# EAGLE design 40khz_ultrasonic_receiver (EAGLE 6.5.0)
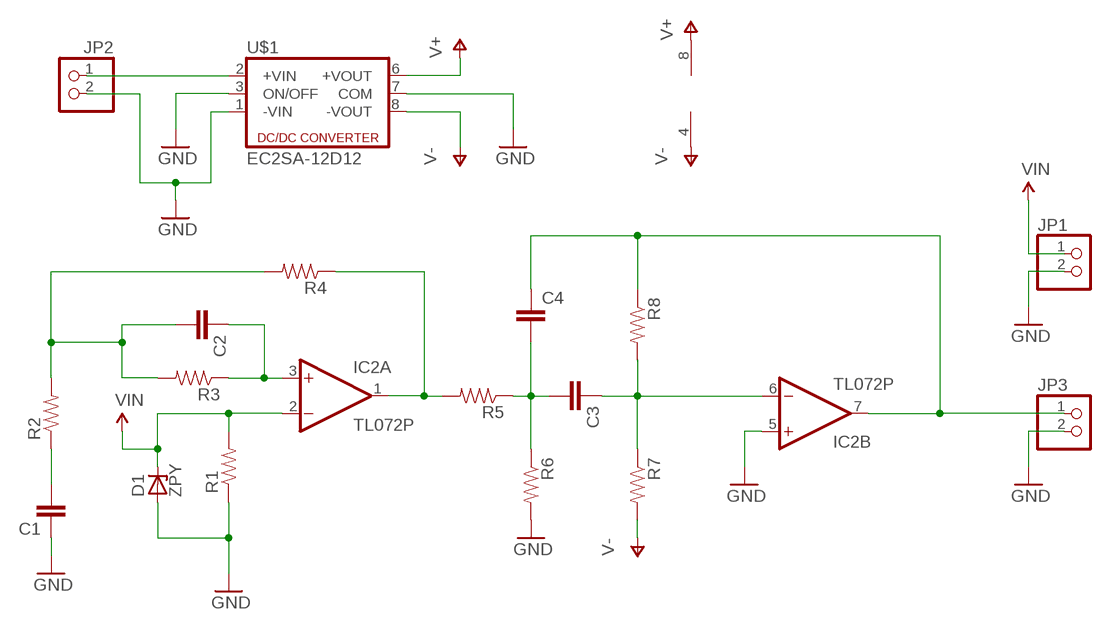
[diagram p0: schematic, sheet 1]

## Parts
C1  CAPPTH  [CAP-PTH-SMALL]
C2  CAPPTH  [CAP-PTH-SMALL]
C3  CAPPTH  [CAP-PTH-SMALL]
C4  CAPPTH  [CAP-PTH-SMALL]
D1  ZPY  [DO41Z10]
IC2  TL072P  [DIL08]
JP1  PINHD-1X2  [1X02]
JP2  PINHD-1X2  [1X02]
JP3  PINHD-1X2  [1X02]
R1  RESISTORPTH-1/4W  [AXIAL-0.4]
R2  RESISTORPTH-1/4W  [AXIAL-0.4]
R3  RESISTORPTH-1/4W  [AXIAL-0.4]
R4  RESISTORPTH-1/4W  [AXIAL-0.4]
R5  RESISTORPTH-1/4W  [AXIAL-0.4]
R6  RESISTORPTH-1/4W  [AXIAL-0.4]
R7  RESISTORPTH-1/4W  [AXIAL-0.4]
R8  RESISTORPTH-1/4W  [AXIAL-0.4]
U$1  EC2SA-12D12  [EC2SA]

## Nets
GND: C1.1 D1.A IC2.5(B:+IN) JP1.2 JP2.2 JP3.2 R1.P$1 R6.P$2 U$1.1(-VIN) U$1.3(ON/OFF) U$1.7(COM)
N$1: IC2.1(A:OUT) R4.P$1 R5.P$2
N$2: C3.2 C4.2 R5.P$1 R6.P$1
N$3: C2.1 IC2.3(A:+IN) R3.P$1
N$4: C4.1 IC2.7(B:OUT) JP3.1 R8.P$1
N$5: C2.2 R2.P$2 R3.P$2 R4.P$2
N$6: C3.1 IC2.6(B:-IN) R7.P$1 R8.P$2
N$7: C1.2 R2.P$1
N$11: JP2.1 U$1.2(+VIN)
V+: IC2.8(P:V+) U$1.6(+VOUT)
V-: IC2.4(P:V-) R7.P$2 U$1.8(-VOUT)
VIN: D1.C IC2.2(A:-IN) JP1.1 R1.P$2

## Library data of the parts
C1-C4 = SparkFun-Passives:CAP: Capacitor Standard 0603 ceramic capacitor, and 0.1" leaded capacitor.
D1 = diode:ZPY: Z DIODE 1 W
IC2 = linear:TL072: OP AMP
JP1-JP3 = pinhead:PINHD-1X2: PIN HEADER
R1-R8 = SparkFun-Passives:RESISTOR: Resistor Basic schematic elements and footprints for 0603, 1206, and PTH resistors.
U$1 = dc-dc-converter:EC2SA-12D12: EC2SA-12D12 Isolated DC/DC Converters 2W 9-18V +/-12V +/-83mA SIP-8 From :http://www.mouser.com/ds/2/75/EC2SA-V16-542561.pdf

## Board
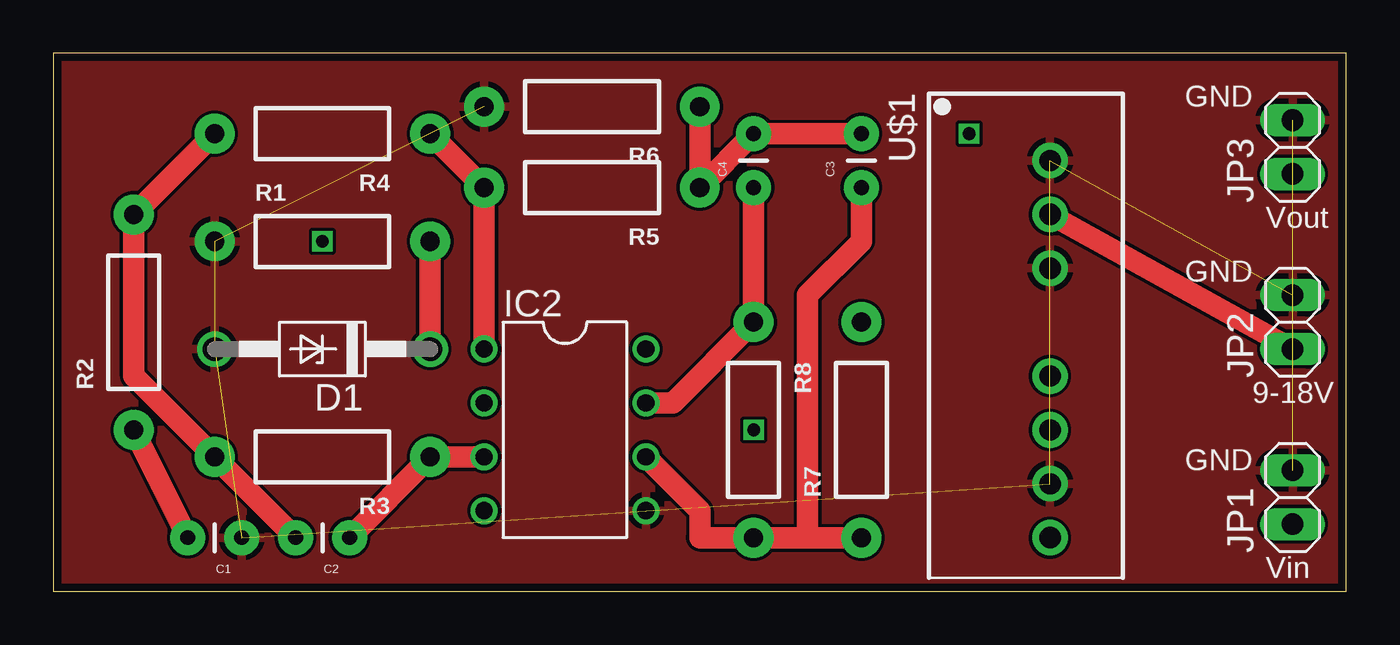
[diagram p1: board, top side]
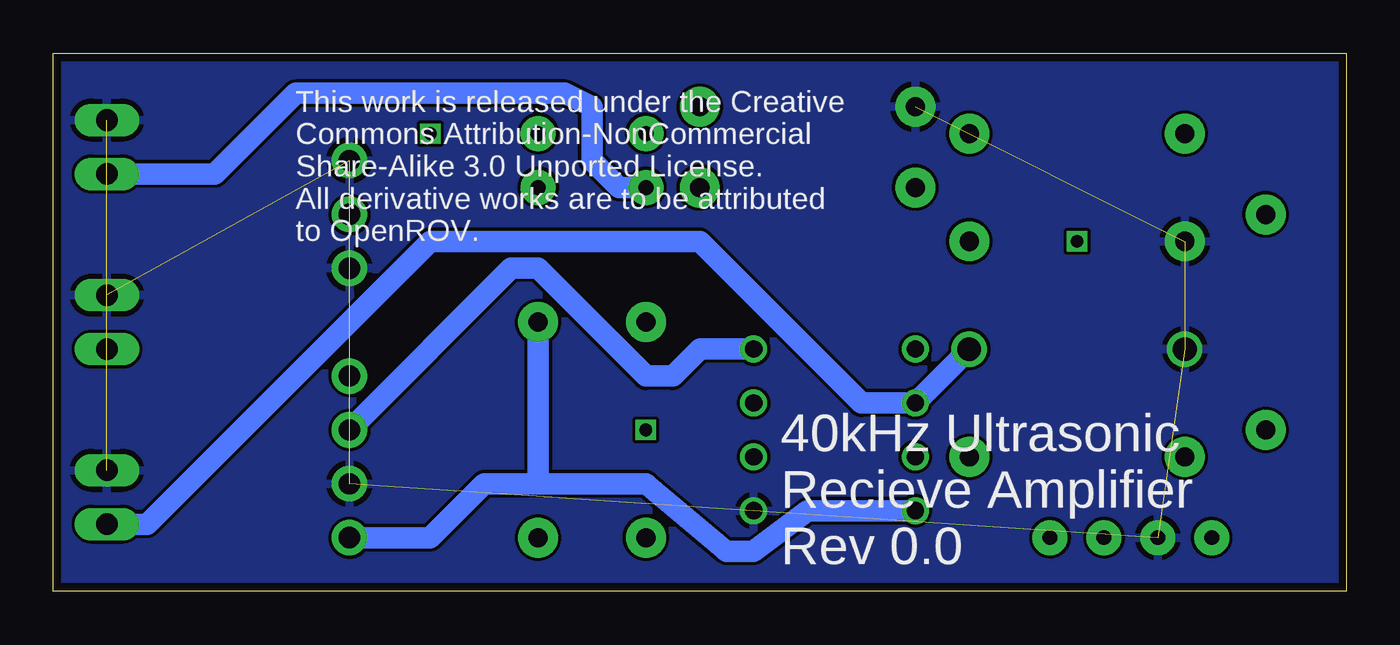
[diagram p2: board, bottom side, seen from below]

Size 60.96 x 25.39 mm. Coordinates in mm from the lower left corner, seen from the top.
Outline: 0,0 60.96,0 60.96,25.39 0,25.39 0,0
Copper layers (1*16): Top 0.0356mm / dielectric 1.5011mm / Bottom 0.0356mm
Design rules "LaenPCBOrder": minimum track width 6mil, minimum drill 13mil, track to track 6mil, track to pad 6mil, pad to pad 6mil, via to via 6mil, smd to smd 6mil, copper to edge 15mil, drill to drill 6mil, minimum pad ring 7mil, minimum via ring 7mil, stop-mask expansion 3mil, vias tented up to drill 0mil, thermal gap 10mil

### Footprints (pad centres in the part's own frame; a part is rotated, then mirrored left to right if it is on the bottom)
CAP-PTH-SMALL = drill 0.7 pad 1.651: 1 0,0; 2 2.54,0
DO41Z10 = drill 1.118: A 5.08,0; C -5.08,0
DIL08 = drill 0.813 pad 1.27: 1 -3.81,-3.81; 2 -1.27,-3.81; 3 1.27,-3.81; 4 3.81,-3.81; 5 3.81,3.81; 6 1.27,3.81; 7 -1.27,3.81; 8 -3.81,3.81
1X02 = drill 1.016 long: 1 -1.27,0; 2 1.27,0
AXIAL-0.4 = drill 0.9 pad 1.88: P$1 -5.08,0; P$2 5.08,0
EC2SA = drill 1 pad 1.676: 1 2.54,6.35; 2 5.08,6.35; 3 7.62,6.35; 5 12.7,6.35; 6 15.24,6.35; 7 17.78,6.35; 8 20.32,6.35

### Placement (x,y rotation side)
C1  8.89,2.54 180 top
C2  13.97,2.54 180 top
C3  38.1,19.05 90 top
C4  33.02,19.05 90 top
D1  12.7,11.43 180 top
IC2  24.13,7.62 270 top
JP1  58.42,4.45 90 top
JP2  58.42,12.7 90 top
JP3  58.42,20.96 90 top
R1  12.7,16.51 0 top
R2  3.81,12.7 90 top
R3  12.7,6.35 180 top
R4  12.7,21.59 180 top
R5  25.4,19.05 180 top
R6  25.4,22.86 180 top
R7  38.1,7.62 90 top
R8  33.02,7.62 270 top
U$1  40.64,22.86 270 top

### Tracks (layer width: path | path; a pad name or v marks a point on that pad's centre or on a via)
GND  (10 unrouted)
  pour Bottom: 0,0 0,25.4 60.96,25.4 60.96,0
  pour Top: 0,25.4 60.96,25.4 60.96,0 0,0
N$1
  Top 1.016: IC2.1 R5.P$2 R4.P$1
N$2
  Top 1.016: R6.P$1 R5.P$1 C4.2 C3.2
N$3
  Top 1.016: IC2.3 R3.P$1 C2.1
N$4
  Top 1.016: C4.1 R8.P$1 29.21,8.89 IC2.7
  Bottom 1.016: C4.1 34.29,19.05 35.56,20.32 35.56,22.86 36.83,23.5 49.53,23.5 53.34,19.69 JP3.1
N$5
  Top 1.016: R4.P$2 R2.P$2 3.81,10.16 R3.P$2 C2.2
N$6
  Top 1.016: 35.56,2.54 R8.P$2 30.48,2.54 30.48,3.81 IC2.6 | 35.56,2.54 R7.P$1 | 35.56,2.54 35.56,13.97 38.1,16.51 C3.1
N$7
  Top 1.016: C1.2 R2.P$1
N$8  (via drill 0.6)
  other vias: 12.7,16.51
N$9  (via drill 0.6)
  other vias: 33.02,7.62
N$10  (via drill 0.6)
  other vias: 43.18,21.59
N$11
  Top 1.016: U$1.2 JP2.1
V+
  Bottom 1.016: IC2.8 30.48,11.43 31.75,10.16 33.02,10.16 38.1,15.24 39.37,15.24 U$1.6
V-
  Bottom 1.016: IC2.4 25.4,3.81 27.94,1.91 29.21,1.91 33.02,5.08 38.1,5.08 | 38.1,5.08 40.64,5.08 43.18,2.54 U$1.8 | R7.P$2 38.1,5.08
VIN
  Top 1.016: D1.C R1.P$2
  Bottom 1.016: D1.C IC2.2 22.86,8.89 30.48,16.51 43.18,16.51 56.52,3.17 JP1.1

### Text on the board
tPlace: GND | Vout | GND | 9-18V | GND | Vin
bPlace: This work is released under the Creative / Commons Attribution-NonCommercial / Share-Alike 3.0 Unported License. / All derivative works are to be attributed / to OpenROV. | 40kHz Ultrasonic / Recieve Amplifier / Rev 0.0